# Altium schematic sheet USBandPOWER.SchDoc
size A4
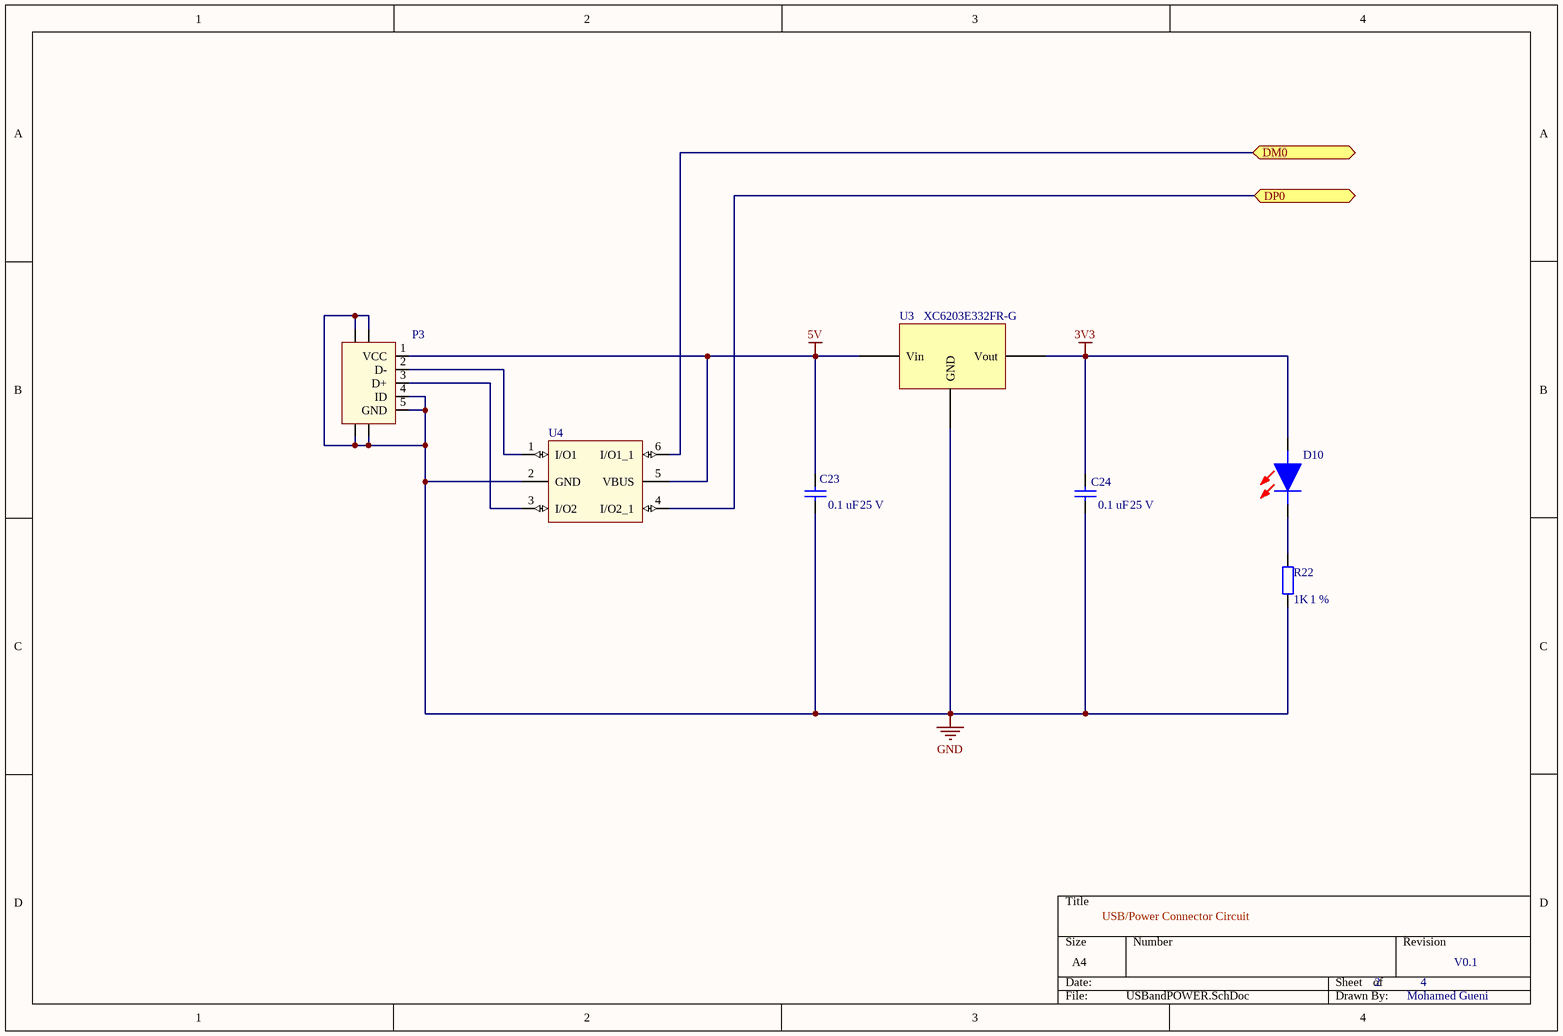
[diagram p0: USBandPOWER.SchDoc]

## Parts
C23  Value 1: 0.1 uF  Value 2: 25 V  [CAP0603]  (hidden comment: Capacitor)
C24  Value 1: 0.1 uF  Value 2: 25 V  [CAP0603]  (hidden comment: Capacitor)
D10  SML-H12U8TT86C  [LEDC2012X90N]  (value not drawn)
P3  USB_minB  [51387-0530]  (value not drawn)
R22  Value 1: 1K  TOL: 1 %  [RES0603]  (hidden comment: Resistor)
U3  MANREF: XC6203E332FR-G  [REG-SOT230P700X180-4N]  (hidden comment: Voltage Regulator)
U4  USBLC6-2SC6  [SOT95P280X145]  (value not drawn)

## Ports
DM0 (bidir), DP0 (bidir)

## Nets
3V3: C24.2 D10.2(A) U3.3(Vout)
5V: C23.2 P3.1(VCC) U3.2(Vin) U4.5(VBUS)
GND: C23.1 C24.1 P3.4(ID) P3.5(GND) P3.SH1(SHIELD) P3.SH2(SHIELD) P3.SH3(SHIELD) P3.SH4(SHIELD) R22.1 U3.1(GND) U4.2(GND)
DM0: U4.6(I/O1_1) ; port DM0
DP0: U4.4(I/O2_1) ; port DP0
NetD10_1: D10.1(K) R22.2
NetP3_2: P3.2(D-) U4.1(I/O1)
NetP3_3: P3.3(D+) U4.3(I/O2)

## Notes on the sheet
- USB/Power Connector Circuit
- 2
- 4
- V0.1
- Mohamed Gueni

## Library data of the parts
C23 C24 = CAP-0005: DES: Multilayer Ceramic Capacitors MLCC - SMD/SMT SOFT 0603 25V 0.1uF X8R 10% AEC-Q200; MAN: TDK; MANREF: CGA3E2X8R1E104K080AE; SUP: Mouser; SUPREF: 810-CGA3E2X8R1E104KA; TOL: 10 %; N°: CAP-0005; Footprint: 0603; DataSheet: https://eu.mouser.com/datasheet/2/400/lcc_automotive_soft_en-843922.pdf
D10 = LED-0002: ROHM - SML-H12U8TT86C - CHIP LED, AEC-Q101, RED, 40MCD, 0805; Manufacturer_Name: ROHM Semiconductor; Geometry.Height: 0.9mm; DES: Standard LEDs - SMD Red 620nm 40mcd 2.2V; 20mA; 0603; SUP: Mouser; SUPREF: 755-SML-H12U8TT86C; Value 1: 20 mA; Value 2: 2.2 V; Mouser Part Number: 755-SML-H12U8TT86C; Mouser Price/Stock: https://www.mouser.com/Search/Refine.aspx?Keyword=755-SML-H12U8TT86C; Manufacturer_Part_Number: SML-H12U8TT86C; Datasheet Link: https://componentsearchengine.com/Datasheets/1/SML-H12U8TT86C.pdf; N°: LED-0002; MAN: ROHM Semiconductor; MANREF: SML-H12U8TT86C; Footprint: 0805 (2012 metric); DataSheet: https://eu.mouser.com/datasheet/2/348/sml-h1(c)-e-1508182.pdf
P3 = P-0002: N°: P-0002; DES: DataBase\PCBLibrary.PcbLib; MAN: Molex; SUP: Mouser; SUPREF: 538-51387-0530; MANREF: 51387-0530; Footprint: THT; DataSheet: https://eu.mouser.com/datasheet/2/276/0513870530_IO_CONNECTORS-170392.pdf
R22 = RES-0001: DES: Thick Film Resistors - SMD 0603 1K 1% High VoltageAEC-Q200; MAN: ROHM Semiconductor; MANREF: KTR03EZPF1001; SUP: Mouser; SUPREF: 755-KTR03EZPF1001; N°: RES-0001; DataSheet: https://eu.mouser.com/datasheet/2/348/ktr-e-1139187.pdf; Footprint: 0603
U3 = U-003: N°: U-003; DES: LDO Voltage Regulators; MAN: Torex Semiconductor; SUP: Mouser; SUPREF: 865-XC6203E332FR-G; Value 2: 8 V; Value 1: 3.3 V; DataSheet: https://eu.mouser.com/datasheet/2/760/XC6203-846590.pdf; Footprint: SOT-223-3
U4 = U-005: TVS Diode Array Uni-Directional USBLC6-2SC6 17V, SOT-23 6-Pin; Manufacturer_Name: STMicroelectronics; Geometry.Height: 1.45mm; N°: U-005; DES: ESD Suppressors / TVS Diodes ESD Protection Low Cap; SUP: Mouser; SUPREF: 511-USBLC6-2SC6; Mouser Part Number: 511-USBLC6-2SC6; Mouser Price/Stock: https://www.mouser.com/Search/Refine.aspx?Keyword=511-USBLC6-2SC6; Manufacturer_Part_Number: USBLC6-2SC6; Datasheet Link: https://componentsearchengine.com/Datasheets/1/USBLC6-2SC6.pdf; MAN: STMicroelectronics; DataSheet: https://eu.mouser.com/datasheet/2/389/usblc6-2-957370.pdf; MANREF: USBLC6-2SC6; Footprint: SOT-666